# Altium schematic sheet Face PCB Micro _ Status LEDs.SchDoc
size A
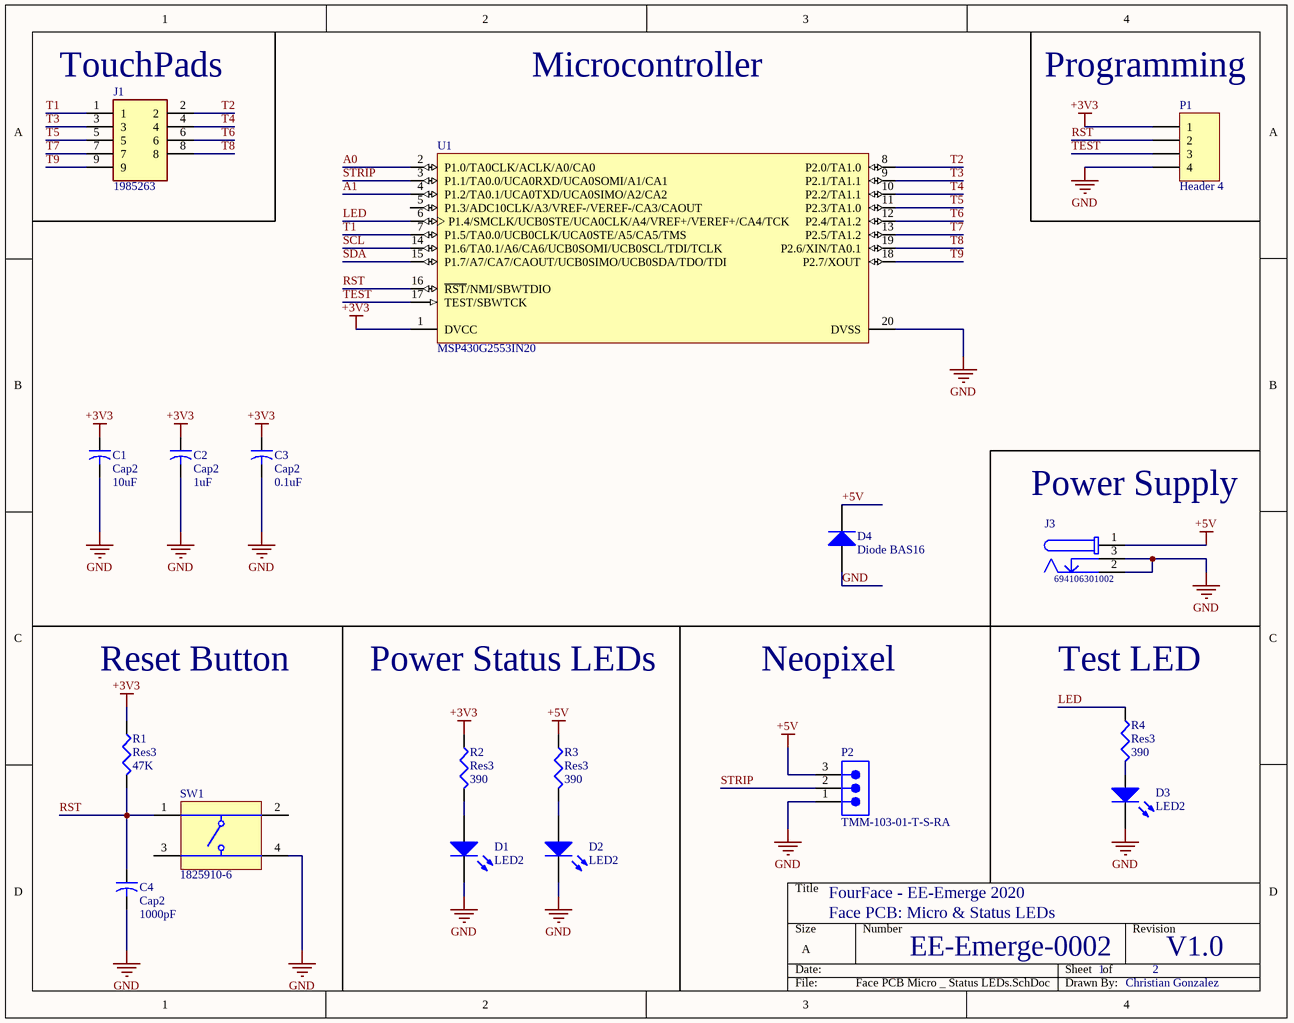
[diagram p0: Face PCB Micro _ Status LEDs.SchDoc]

## Parts
C1  Cap2  value 10uF  [C0805]
C2  Cap2  value 1uF  [C0805]
C3  Cap2  value 0.1uF  [C0805]
C4  Cap2  value 1000pF  [C0805]
D1  LED2  [3.2X1.6X1.1]
D2  LED2  [3.2X1.6X1.1]
D3  LED2  [3.2X1.6X1.1]
D4  Diode BAS16  [SOT-23_N]
J1  1985263  [1985263]
J3  694106301002  [694106301002]
P1  Header 4  [HDR1X4]
P2  TMM-103-01-T-S-RA  [SMTC-TMM-103-01-X-S-RA]
R1  Res3  value 47K  [6-0805_N]
R2  Res3  value 390  [6-0805_N]
R3  Res3  value 390  [6-0805_N]
R4  Res3  value 390  [6-0805_N]
SW1  1825910-6  [TECO-1825910-6_V]
U1  MSP430G2553IN20  [N0020A]

## Nets
+3V3: C1.1 C2.1 C3.1 P1.1 R1.1 R2.1 U1.1(DVCC)
+5V: D4.3(K) J3.1 P2.3 R3.1
GND: C1.2 C2.2 C3.2 C4.2 D1.2(K) D2.2(K) D3.2(K) D4.1(A) J3.2 J3.3 P1.4 P2.1 SW1.4 U1.20(DVSS)
A0: U1.2(P1.0/TA0CLK/ACLK/A0/CA0)
A1: U1.4(P1.2/TA0.1/UCA0TXD/UCA0SIMO/A2/CA2)
LED: R4.1 U1.6(P1.4/SMCLK/UCB0STE/UCA0CLK/A4/VREF+/VEREF+/CA4/TCK)
RST: C4.1 P1.2 R1.2 SW1.1 U1.16(~{RST}/NMI/SBWTDIO)
SCL: U1.14(P1.6/TA0.1/A6/CA6/UCB0SOMI/UCB0SCL/TDI/TCLK)
SDA: U1.15(P1.7/A7/CA7/CAOUT/UCB0SIMO/UCB0SDA/TDO/TDI)
STRIP: P2.2 U1.3(P1.1/TA0.0/UCA0RXD/UCA0SOMI/A1/CA1)
T1: J1.1 U1.7(P1.5/TA0.0/UCB0CLK/UCA0STE/A5/CA5/TMS)
T2: J1.2 U1.8(P2.0/TA1.0)
T3: J1.3 U1.9(P2.1/TA1.1)
T4: J1.4 U1.10(P2.2/TA1.1)
T5: J1.5 U1.11(P2.3/TA1.0)
T6: J1.6 U1.12(P2.4/TA1.2)
T7: J1.7 U1.13(P2.5/TA1.2)
T8: J1.8 U1.19(P2.6/XIN/TA0.1)
T9: J1.9 U1.18(P2.7/XOUT)
TEST: P1.3 U1.17(TEST/SBWTCK)
NetD1_1: D1.1(A) R2.2
NetD2_1: D2.1(A) R3.2
NetD3_1: D3.1(A) R4.2

Not connected (* = marked no-connect by the designer): SW1 2 3; U1 5(P1.3/ADC10CLK/A3/VREF-/VEREF-/CA3/CAOUT)

## Notes on the sheet
- (near J1) TouchPads
- Microcontroller
- (near P1) Programming
- (near J3) Power Supply
- Reset Button
- Power Status LEDs
- Neopixel
- (near R4) Test LED
- FourFace - EE-Emerge 2020
- Face PCB: Micro & Status LEDs
- EE-Emerge-0002
- 1
- 2
- V1.0
- Christian Gonzalez

## Library data of the parts
C1 C3 C4 = Cap2: Capacitor; Published: 23-Sep-2002; PackageReference: CAPR5-4X5; Publisher: Altium Limited; PackageDescription: Capacitor; 2 Leads
C2 = Cap2_4: Capacitor; Published: 23-Sep-2002; PackageReference: CAPR5-4X5; Publisher: Altium Limited; PackageDescription: Capacitor; 2 Leads
D1-D3 = LED2: Typical RED, GREEN, YELLOW, AMBER GaAs LED; Published: 8-Jun-2000; LatestRevisionDate: 17-Jul-2002; LatestRevisionNote: Re-released for DXP Platform.; PackageVersion: Feb-2002; PackageReference: 3.2X1.6X1.1; Publisher: Altium Limited; PackageDescription: SM LED; 2 Flat Leads
D4 = Diode BAS16: Silicon Switching Diode for High-Speed Switching; Note: Pin 2 is not connected and not drawn.; Published: 21-Mar-2003; LatestRevisionDate: 29-May-2009; LatestRevisionNote: IPC-7351 Footprint Added.; DatasheetVersion: Oct-1999; PackageVersion: Sep-2001; PackageReference: SOT-23; Publisher: Altium Limited; PackageDescription: 3-Pin SOT-23 Package 0.95 mm Pitch, 2.5 mm Lead Span; ComponentLink1Description: Manufacturer Link; ComponentLink1URL: http://www.infineon.com/; ComponentLink2Description: Datasheet; ComponentLink2URL: http://www.infineon.com/upload/Document/cmc_upload/documents/012/5331/bas16series.pdf
J1 = 1985263: Connector; Manufacturer_Name: Phoenix Contact; Allied_Number: 70055076; Datasheet Link: https://www.phoenixcontact.com/online/portal/us?uri=pxc-oc-itemdetail:pid=1985263&library=usen&tab=1; Height: 13mm; Manufacturer_Part_Number: 1985263; Mouser Part Number: 651-1985263; Mouser Price/Stock: https://www.mouser.com/Search/Refine.aspx?Keyword=651-1985263; RS Part Number: 6482559; RS Price/Stock: http://uk.rs-online.com/web/p/products/6482559; Allied Price/Stock: https://www.alliedelec.com/phoenix-contact-1985263/70055076/
J3 = CMP-1502-00188-1: DC Power Jack Connector WR-DC, Male, Right Angled, THT, 5 A, 24 V; Manufacturer: Wurth Elektronik; Plug Inner Diameter: 2.05mm; Opening Diameter: 6.4mm; Rated Current: 5A; Plug Outer Diameter: 5.5mm; Working Voltage: 24V; Datasheet URL: http://katalog.we-online.de/em/datasheet/6941xx301002.pdf; Packaging: Bag; Manufacturer URL: http://www.we-online.de; Part Number: 694106301002; Gender: Male; Publisher: WurthElektronik; Operating Temperature: -40to85degC; Mounting Technology: THT; Package Reference: 694106301002; Orientation: RightAngled
P1 = Header 4: Header, 4-Pin; LatestRevisionDate: 17-Jul-2002; LatestRevisionNote: Re-released for DXP Platform.; Publisher: Altium Limited
P2 = CMP-1029-00176-1: Low Profile Through-Hole Header, Right Angle, -55 to 105 degC, 2 mm Pitch, 3-Pin, Male, RoHS; Manufacturer: Samtec; Pitch: 2 mm; PackageDescription: 2 mm Terminal Strip Assembly (R/A); Mounting Technology: Through-hole; ComponentLink3URL: http://www.samtec.com/documents/webfiles/cpdf/TMM-1XX-XX-XX-X-RA-XXX-MKT.pdf; RoHS: True; Temperature Range: -55 to 105 degC; PackageVersion: V, 3/2013; ComponentLink3Description: Package Specification; ComponentLink1Description: Manufacturer URL; ComponentLink2Description: Datasheet; PackageReference: TMM-103-01-X-S-RA; ComponentLink1URL: http://www.samtec.com; PartNumber: TMM-103-01-T-S-RA; DatasheetVersion: F-214; Orientation: Right Angle; ComponentLink2URL: http://d2a072wq521u33.cloudfront.net/catalog_english//TMM_TH.PDF; Manufacturer 1: Samtec; Manufacturer Part Number 1: TMM-103-01-T-S-RA
R1-R4 = Res3: Resistor; Published: 8-Jun-2000; LatestRevisionDate: 29-May-2009; LatestRevisionNote: IPC-7351 Footprint Added.; PackageReference: J1-0603; Publisher: Altium Limited; PackageDescription: Chip Resistor
SW1 = CMP-1684-00021-1: Tact Switch, SPST-NO, 0.05 A, -35 to 85 degC, 4-Pin THD, RoHS, Bulk; Manufacturer: TE Connectivity; Maximum Contact Resistance: 100mOhm; Mechanical Life: 100000Cycles; Bushing Type: Unthreaded; Switch Configuration: OFF(ON); Maximum DC Voltage Rating: 24V; Contact Rating @ Voltage: 0.05A@24VDC; Actuator Color: Black; Body Orientation: Straight; Function: MomentaryContact; Illumination: N/R; Actuator Style: RoundButton; Actuator Material: PolybutyleneTerephthalate; Dielectric Strength: 500VAC; Pole Throw Configuration: SPST; Actuator Length: 1.4mm; Product Weight: N/A; Contact Material: CopperAlloy; Housing Material: N/A; Terminal Type: PCPins; Minimum Insulation Resistance: 100MOhm; Package Description: 4-Pin Through Hole Device, Body 5.99 x 5.99 mm, Pitch 6.5 mm; Part No: 1825910-6; Package Reference: THD; Base Material: N/A; Manufacturer URL: http://www.te.com; Contact Plating: Silver; RoHS: Yes; Datasheet Version: Rev. C9; Electrical Life: 100000Cycles; Maximum AC Voltage Rating: N/A; Thread Size: N/R; Operating Temperature: -35to85C; Mounting: ThroughHole; Dimension: 5.99x5mm; Datasheet URL: http://www.te.com/commerce/DocumentDelivery/DDEController?Action=showdoc&DocId=Customer+Drawing%7F1825910%7FC9%7Fpdf%7FEnglish%7FENG_CD_1825910_C9.pdf%7F1825910-6; Family: 1825910; Seal Location: N/A; Seal Description: N/A; Packaging: N/A
U1 = CMP-0365-00184-2: 16 MHz Mixed Signal Microcontroller with 16 KB Flash, 512 B SRAM and 24 GPIOs, -40 to 85 degC, 20-pin DIP (N), Pb-Free (RoHS); Manufacturer: Texas Instruments; USCI_B (I2C & SPI): 1; Temp Sensor: Yes; SubFamily: Value Line; Frequency(MHz): 16; ADC Channels: 8; SRAM(B): 512; ADC: 10-bit SAR; GPIO: 24; Timers - 16-bit: 2; Code_JEDEC: MS-001; Eco-Plan: Pb-Free (RoHS); PartNumber: MSP430G2553IN20; ComponentLink1URL: http://www.ti.com/; PackageVersion: 4040049/E; Comparators: Yes; Watchdog: Yes; ComponentLink2Description: Datasheet; ComponentLink1Description: Manufacturer URL; Mounting Technology: Through Hole; ComponentLink2URL: http://www.ti.com/general/docs/lit/getliterature.tsp?genericPartNumber=MSP430G2553&fileType=pdf; Brown Out Reset: Yes; PackageReference: N0020A; PackageDescription: 20-Pin Plastic In-Line, Body 25.40 x 6.35 mm, Pitch 2.54 mm; ComponentLink3URL: http://www.ti.com/litv/pdf/mpds177g; ComponentLink3Description: Package Specification; Flash(KB): 16; Cap touch I/O: Yes; USCI_A (UART/LIN/IrDA/SPI): 1; DatasheetVersion: SLAS735G; Manufacturer 1: Texas Instruments; Manufacturer Part Number 1: MSP430G2553IN20